# EAGLE schematic pro_micro_and_sensors (EAGLE 8.6.3)
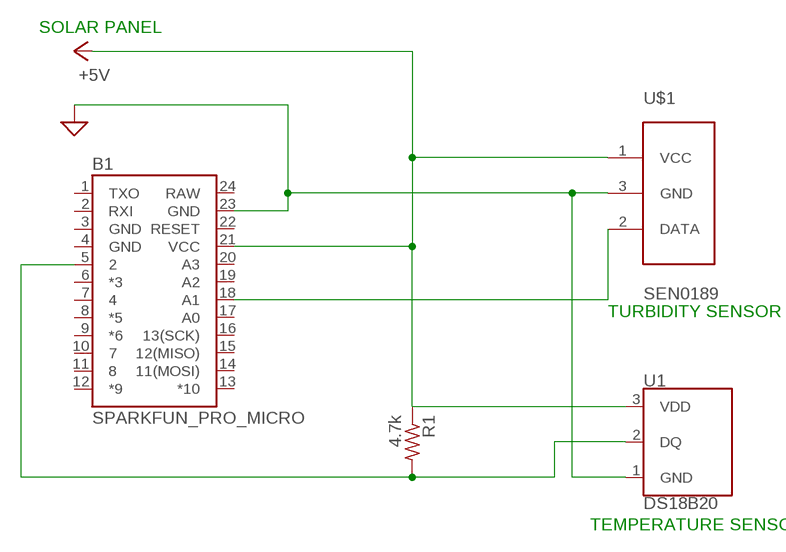
[diagram p0: schematic, sheet 1]

## Parts
B1  SPARKFUN_PRO_MICRO  [SPARKFUN_PRO_MICRO]
R1  4.7k  R-US_0204/7  [0204/7]
U1  DS18B20  [TO-92-AMMO]
U$1  SEN0189  [SEN0189]

## Nets
+5V: B1.21(VCC) R1.1 U1.3(VDD) U$1.1(VCC)
GND: B1.23(GND) U1.1(GND) U$1.3(GND) ; supply symbol labelled SUP
N$2: B1.5 R1.2 U1.2(DQ)
N$4: B1.18(A1) U$1.2(DATA)
Unconnected: B1.1(TXO) B1.2(RXI) B1.6(*3) B1.7 B1.8(*5) B1.9(*6) B1.10 B1.11 B1.12(*9) B1.13(*10) B1.14(11(MOSI)) B1.15(12(MISO)) B1.16(13(SCK)) B1.17(A0) B1.19(A2) B1.20(A3) B1.22(RESET)

## Notes on the sheet
- SOLAR PANEL
- TURBIDITY SENSOR
- TEMPERATURE SENSOR

## Power pins joined to a net without a drawn wire
GND: B1.3(GND) B1.4(GND)
RAW: B1.24(RAW)

## Library data of the parts
B1 = SparkFun-Boards:SPARKFUN_PRO_MICRO: SparkFun Pro Micro Atmega32U4 compatible footprint. SparkFun Products: 3.3V/8MHz <https://www.sparkfun.com/products/12587> 5V/16MHz <https://www.sparkfun.com/products/12640>
R1 = adafruit:R-US_: RESISTOR, American symbol
U1 = SparkFun-Sensors:DS18B20: Dallas/Maxim DS18B20 1-Wire Temperature Sensor The DS18B20 reports degrees C with 9 to 12-bit precision, -55C to 125C (+/-0.5C). Each sensor has a unique 64-Bit Serial number etched into it - allows for a huge number of sensors to be used on one data bus. Datasheet <http://datasheets.maximintegrated.com/en/ds/DS18B20.pdf> SparkFun Products One Wire Digital Temperature Sensor - DS18B20 <https://www.sparkfun.com/products/245> (SEN-00245); STORE_ID: SEN-00245
U$1 = sen0189:SEN0189